# Altium schematic sheet Flows.SchDoc: Title of General Schematic Template
size 1651 x 1651 mm; Date: -; ApprovedBy: -; CheckedBy: -; Author: -; CompanyName: -; DrawnBy: -; Engineer: -; Organization: -; Address1: -; Address2: -; Address3: -; Address4: -; DocumentNumber: -; Revision: -; SheetNumber: -; SheetTotal: -; Time: -; ImagePath: -; Application_BuildNumber: -
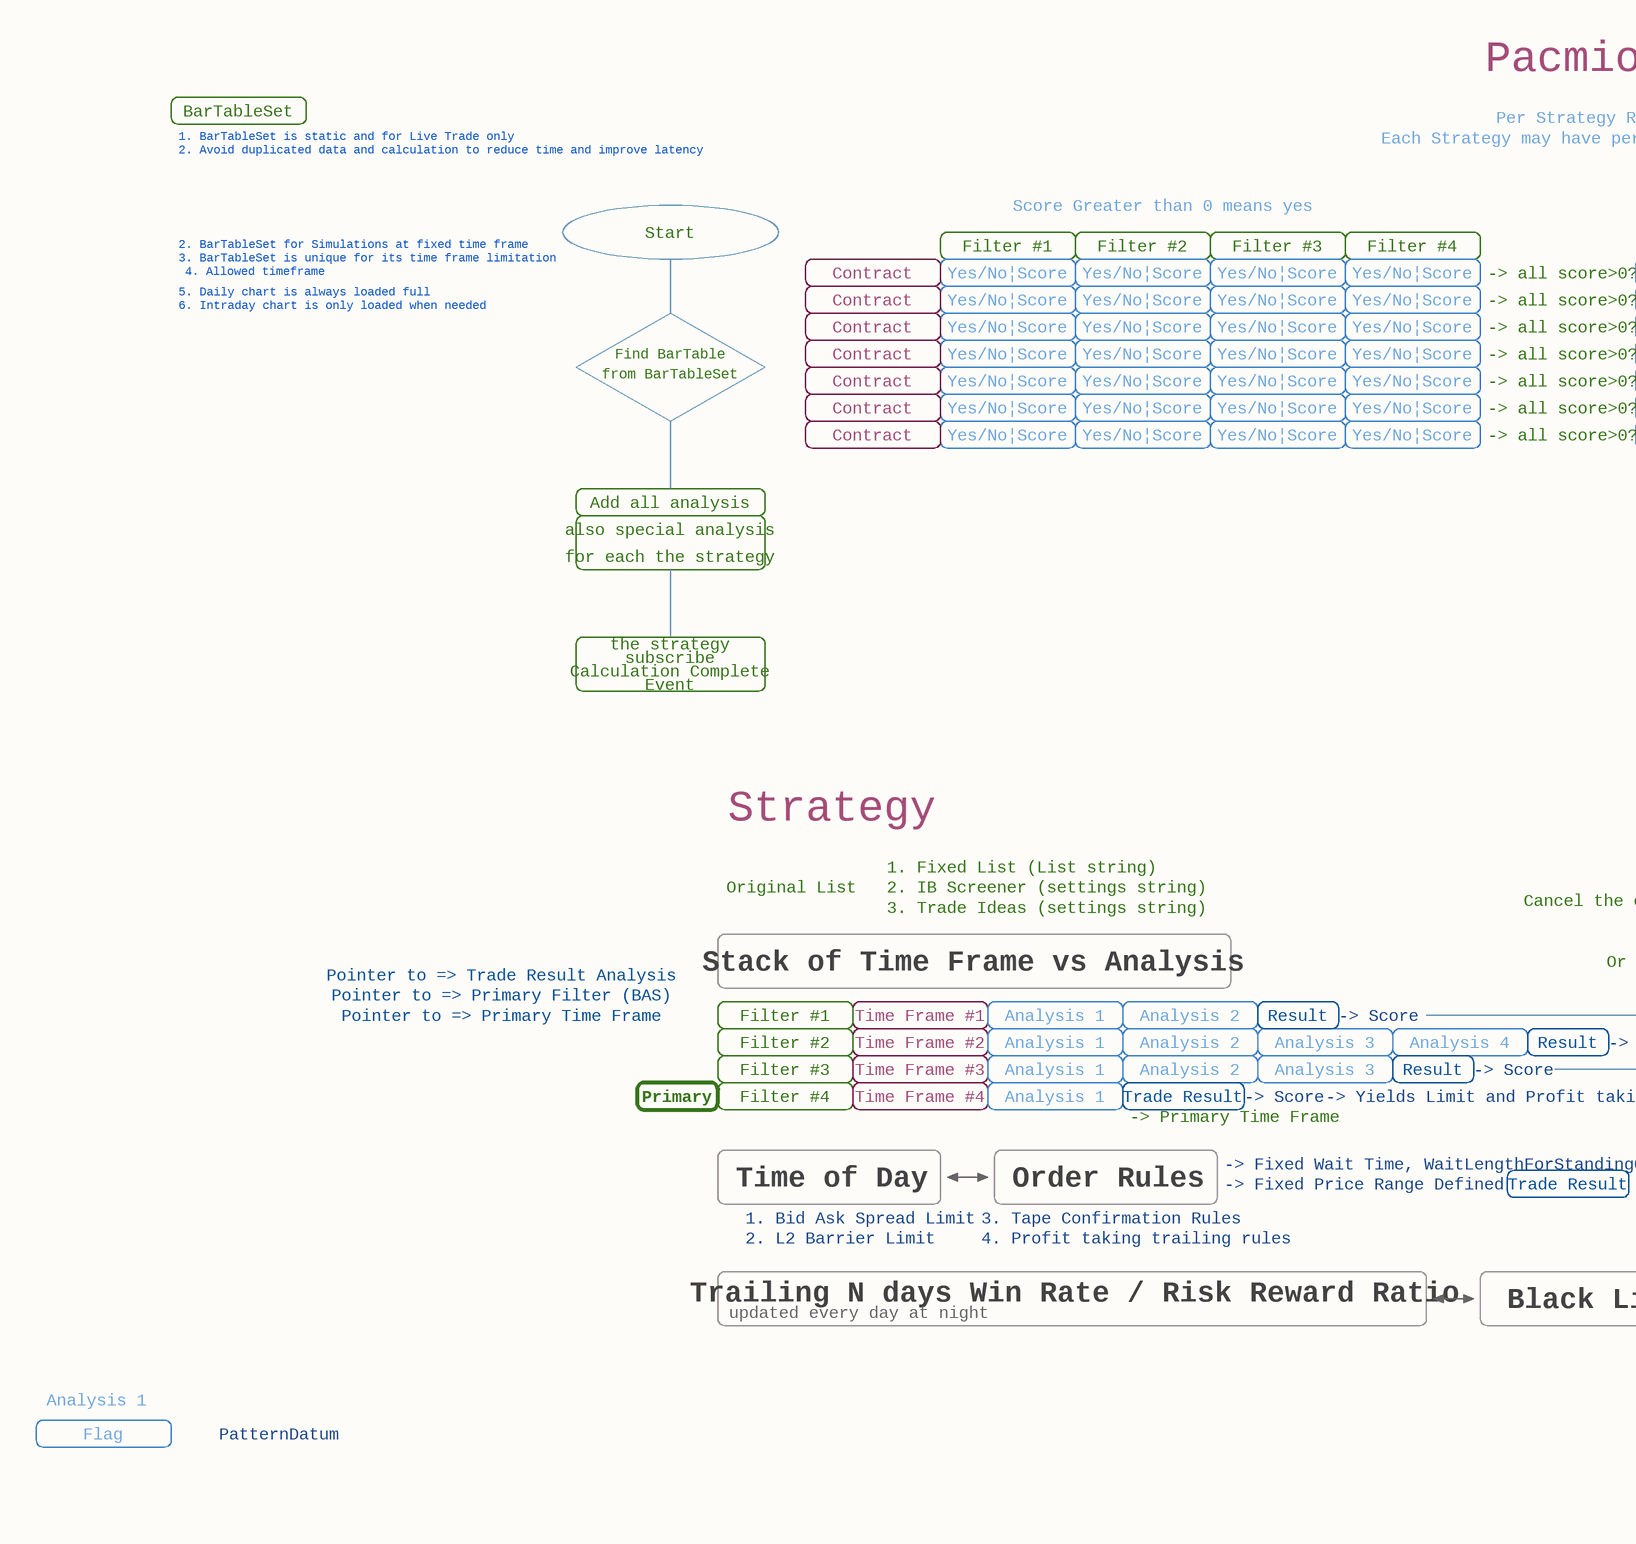
[diagram p0: Flows.SchDoc, left]
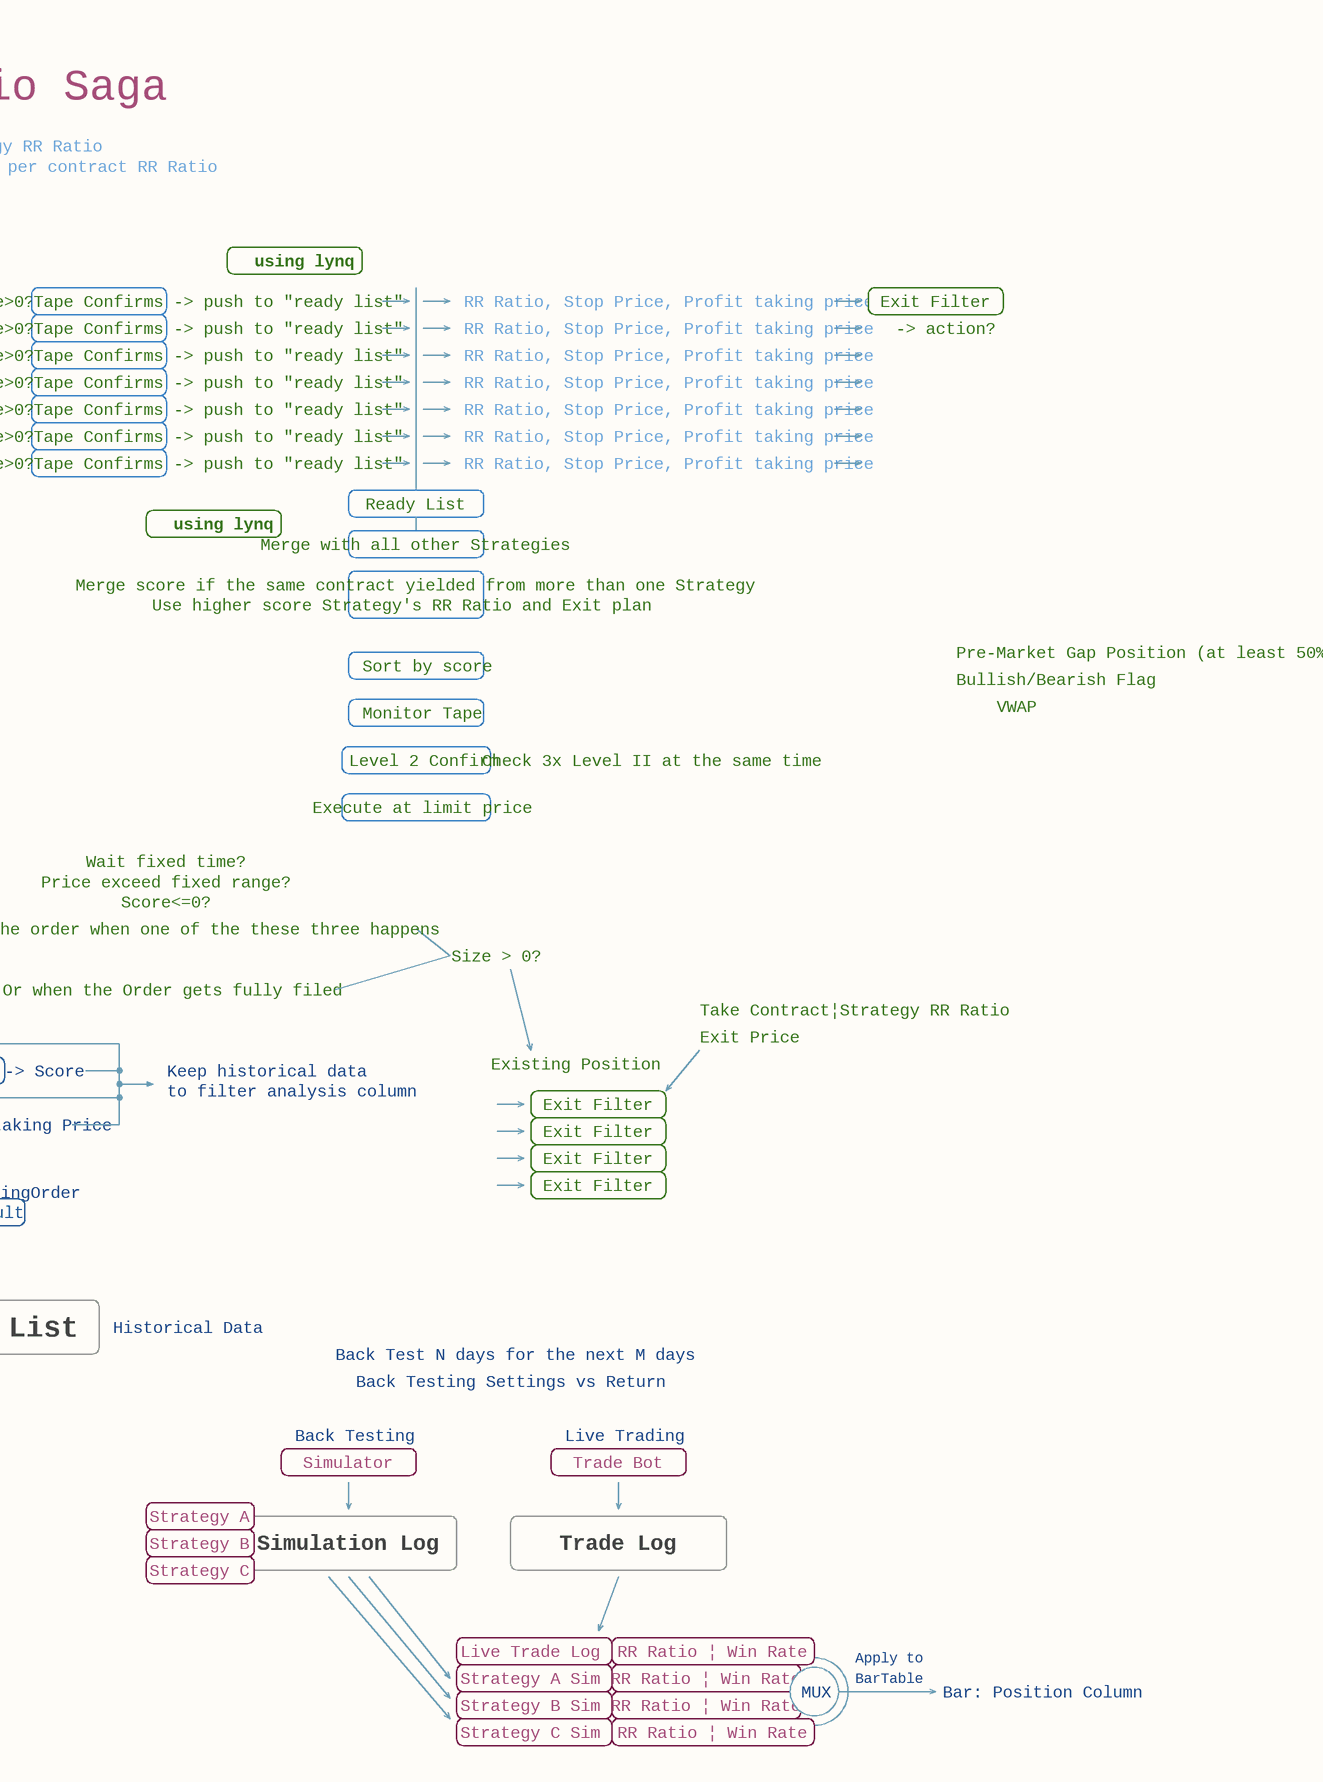
[diagram p1: Flows.SchDoc, right]

## Notes on the sheet
- Pacmio Saga
- BarTableSet
- Per Strategy RR Ratio
- 1. BarTableSet is static and for Live Trade only
- 2. Avoid duplicated data and calculation to reduce time and improve latency
- Each Strategy may have per contract RR Ratio
- 2. BarTableSet for Simulations at fixed time frame
- 3. BarTableSet is unique for its time frame limitation
- Start
- Filter #1
- Filter #2
- Score Greater than 0 means yes
- Filter #3
- Filter #4
- using lynq
- 5. Daily chart is always loaded full
- 6. Intraday chart is only loaded when needed
- 4. Allowed timeframe
- Contract
- Yes/No|Score
- -> all score>0?
- Tape Confirms
- -> push to "ready list"
- RR Ratio, Stop Price, Profit taking price
- -> action?
- Exit Filter
- Find BarTable
- from BarTableSet
- Add all analysis
- also special analysis
- Ready List
- Merge with all other Strategies
- for each the strategy
- Use higher score Strategy's RR Ratio and Exit plan
- Merge score if the same contract yielded from more than one Strategy
- the strategy
- subscribe
- Calculation Complete
- Sort by score
- Pre-Market Gap Position (at least 50%, prefer top 20%)
- Bullish/Bearish Flag
- Event
- Level 2 Confirm
- Monitor Tape
- Check 3x Level II at the same time
- VWAP
- Strategy
- Execute at limit price
- 1. Fixed List (List string)
- Wait fixed time?
- Price exceed fixed range?
- Original List
- 2. IB Screener (settings string)
- 3. Trade Ideas (settings string)
- Score<=0?
- Cancel the order when one of the these three happens
- Size > 0?
- Pointer to => Trade Result Analysis
- Pointer to => Primary Filter (BAS)
- Stack of Time Frame vs Analysis
- Or when the Order gets fully filed
- Take Contract|Strategy RR Ratio
- Pointer to => Primary Time Frame
- Time Frame #1
- Time Frame #2
- Time Frame #3
- Analysis 1
- Analysis 2
- Result
- Analysis 3
- -> Score
- Analysis 4
- Keep historical data
- to filter analysis column
- Existing Position
- Exit Price
- Primary
- Time Frame #4
- -> Primary Time Frame
- Trade Result
- -> Yields Limit and Profit taking Price
- Time of Day
- Order Rules
- -> Fixed Wait Time, WaitLengthForStandingOrder
- -> Fixed Price Range Defined by
- 1. Bid Ask Spread Limit
- 2. L2 Barrier Limit
- 3. Tape Confirmation Rules
- 4. Profit taking trailing rules
- updated every day at night
- Trailing N days Win Rate / Risk Reward Ratio
- Black List
- Historical Data
- Back Test N days for the next M days
- Back Testing
- Back Testing Settings vs Return
- Live Trading
- Flag
- PatternDatum
- Simulator
- Trade Bot
- Strategy A
- Strategy B
- Strategy C
- Simulation Log
- Trade Log
- Live Trade Log
- Strategy A Sim
- Strategy B Sim
- RR Ratio | Win Rate
- MUX
- Apply to
- BarTable
- Bar: Position Column
- Strategy C Sim